# EasyEDA Pro project HNDX.eprj, board PCB21
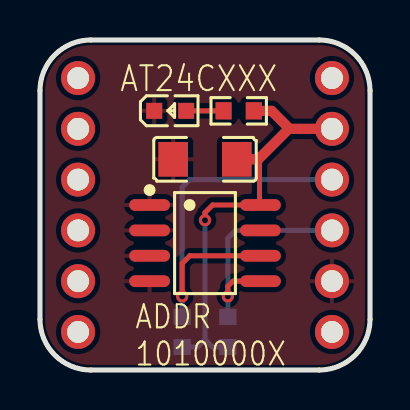
[diagram p13: board, top side]
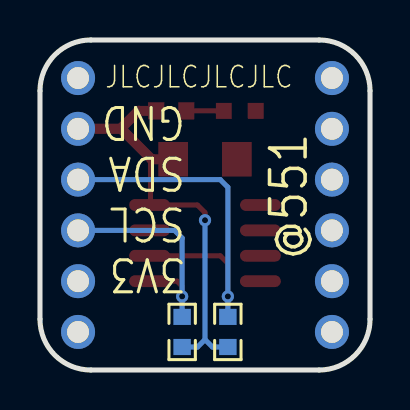
[diagram p14: board, bottom side, seen from below]

Outline 16.51 x 16.51 mm; copper layers: Top Layer, Bottom Layer. Coordinates in mm from the lower left corner of the outline.
Outline path: 0,13.97 arc(0.74,15.77) 2.54,16.51 13.97,16.51 arc(15.77,15.77) 16.51,13.97 16.51,2.54 arc(15.77,0.74) 13.97,0 2.54,0 arc(0.74,0.74) 0,2.54 0,13.97
Stack: Top Layer 0.035mm / Dielectric1 1.51mm FR4 er 4.5 / Bottom Layer 0.035mm

## Design rules (mm)
template: JLCPCB Capability(Two Layers Board)
spacing copperThickness1oz (default): track to track 0.102, other pairs 0.152 to 0.3
spacing copperThickness2oz: track to track 0.203, other pairs 0.152 to 0.3
track width copperThickness1oz (default): min 0.127, default 0.254, max 2.54
track width copperThickness2oz: min 0.203, default 0.254, max 2.54
differential pair differentialPair (default): width min 0.127, default 0.254, max 2.54; gap min 0.152, default 0.152
via viaSize (default): diameter min 0.5, default 0.61, max 10; hole min 0.3, default 0.305, max 6.3

## Placement (name value [footprint] x y rotation side)
C1  10uF  [C1206]  8.26 10.54 0 top
H1  -  [HDR-TH_6P-P2.54-V-M]  14.61 8.26 90 top
H2  -  [HDR-TH_6P-P2.54-V-M]  1.91 8.26 90 top
LED1  LTST-C190KSKT  [LED0603-RD]  6.52 12.96 0 top
R1  1kΩ  [R0603]  7.11 1.91 90 bottom
R2  1kΩ  [R0603]  9.4 1.91 90 bottom
R3  1kΩ  [R0603]  9.94 12.96 0 top
U1  AT24C256C-SSHL-T  [SOIC-8_L4.9-W3.9-P1.27-LS6.0-BL]  8.26 6.35 270 top

## Footprints (pads in the part's own frame, mm; a bottom-side part is the same pattern mirrored in y, then rotated)
C1206
  rect 1.485x1.728 smd: 1(-1.593,0) 2(1.593,0)
HDR-TH_6P-P2.54-V-M
  round 1.7 hole 1.1: 1(-6.35,0) 2(-3.81,0) 3(-1.27,0) 4(1.27,0) 5(3.81,0) 6(6.35,0)
LED0603-RD
  rect 0.8x0.8 smd: 1(-0.799,0) 2(0.799,0)
R0603
  rect 0.806x0.864 smd: 1(-0.753,0) 2(0.753,0)
SOIC-8_L4.9-W3.9-P1.27-LS6.0-BL
  oval 0.588x2.045 smd: 1(-1.905,-2.772) 2(-0.635,-2.772) 3(0.635,-2.772) 4(1.905,-2.772) 5(1.905,2.772) 6(0.635,2.772) 7(-0.635,2.772) 8(-1.905,2.772)

## Nets
As in the schematic.

Pads without a net: H1 1 6; H2 1 2 3 4 5 6

## Via types
v1: diameter 0.61, hole 0.305, Top Layer to Bottom Layer, 3 vias

## Routing (per net, layer and track width the routed paths; a pad name or vN(x,y) marks a point on that pad's centre or on a via; arc(x,y) is an arc through that point)
+3.3V: length 21.7
  Top Layer w0.254: v1(8.26,7.49) 8.26,7.87 8.64,8.26 U1.8 10.98,8.3 10.98,10.59
  Top Layer w0.508: R3.2 11.59,12.96 12.42,12.13 ; H1.5 12.45,12.06 10.92,10.54 C1.2
  Bottom Layer w0.254: 8.26,1.52 8.63,1.15 R2.1 ; 8.26,1.52 v1(8.26,7.49) ; 8.26,1.52 7.88,1.15 R1.1
SCL: length 19.9
  Top Layer w0.254: U1.6 7.49,5.72 7.11,5.33 v1(7.11,3.68)
  Bottom Layer w0.254: R1.2 v1(7.11,3.68) 7.11,9.14 7.49,9.53 H1.4
SDA: length 11.6
  Top Layer w0.254: U1.5 9.65,4.45 9.4,4.19 v1(9.4,3.68)
  Bottom Layer w0.254: H1.3 9.78,6.98 9.4,6.6 v1(9.4,3.68) R2.2
$1N1146: length 1.9
  Top Layer w0.254: R3.1 LED1.2

## Copper pours and planes (outline as drawn; the poured copper is in the pictures)
GND on Top Layer: 16.76,0 -0.25,0 -0.25,16.76 16.76,16.76

## Text on the board
Bottom Silkscreen Layer: JLCJLCJLCJLC | SDA | SCL | 3V3 | GND | @551
Top Silkscreen Layer: ADDR / 1010000X | AT24CXXX
